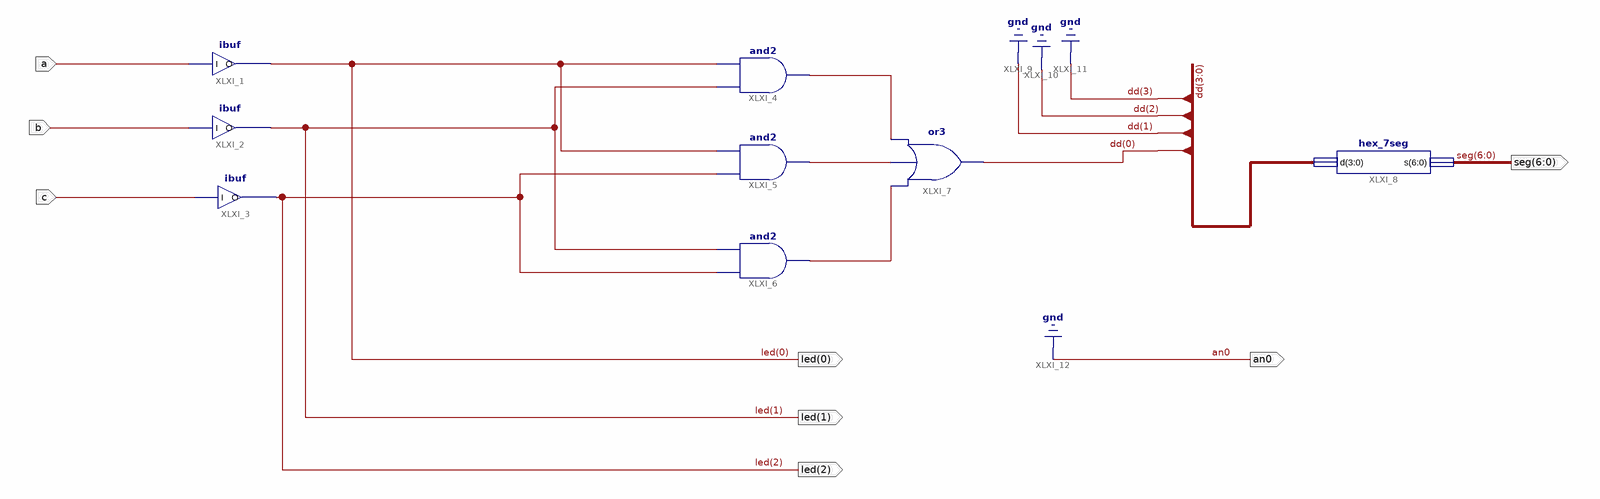
[diagram p0: schematic sheet 1]
// Xilinx ISE schematic szavazo.sch (spartan3e) as structural Verilog: 8 symbols, 8 ports
module szavazo (
  input  a,
  input  b,
  input  c,
  output [6:0] seg,
  output [2:0] led,
  output an0
);

  wire XLXN_12, XLXN_13, XLXN_14;
  wire [0:0] dd;

  ibuf XLXI_1 (.I(a), .O(led[0]));
  ibuf XLXI_2 (.I(b), .O(led[1]));
  ibuf XLXI_3 (.I(c), .O(led[2]));
  and XLXI_4 (XLXN_12, led[1], led[0]);
  and XLXI_5 (XLXN_13, led[2], led[0]);
  and XLXI_6 (XLXN_14, led[2], led[1]);
  or XLXI_7 (dd[0], XLXN_14, XLXN_13, XLXN_12);
  hex_7seg XLXI_8 (.d({3'b000, dd[0]}), .s(seg));

  assign an0 = 1'b0;
endmodule
